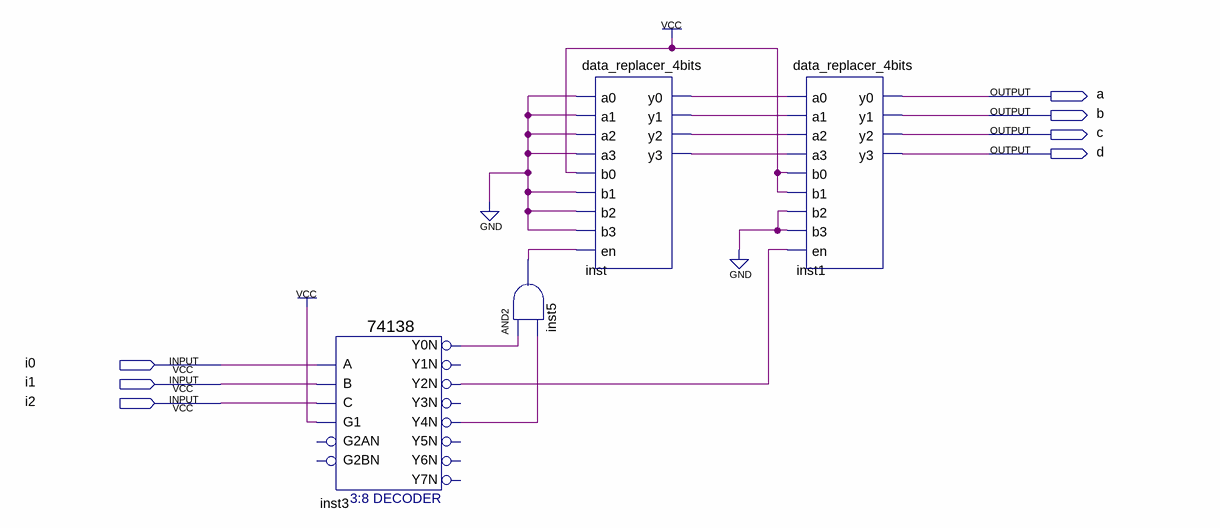
[diagram p0: schematic sheet]
// Quartus schematic data_state_picker_3b_4bitso.bdf as structural Verilog: 4 symbols, 7 pins
module data_state_picker_3b_4bitso (
  input  i0,
  input  i1,
  input  i2,
  output a,
  output b,
  output c,
  output d
);

  wire inst3_y0n, inst3_y2n, inst3_y4n, inst5_out, inst_y0, inst_y1, inst_y2, inst_y3;

  \74138  inst3 (
    .A(i0), .B(i1), .G1(1'b1), .C(i2), .Y0N(inst3_y0n), .Y2N(inst3_y2n), .Y4N(inst3_y4n));  // open: G2AN, G2BN, Y1N, Y3N, Y5N, Y6N, Y7N
  and inst5 (inst5_out, inst3_y0n, inst3_y4n);
  data_replacer_4bits inst (
    .a0(1'b0), .a1(1'b0), .a2(1'b0), .a3(1'b0), .b0(1'b1), .b1(1'b0), .b2(1'b0), .b3(1'b0), .en(inst5_out),
    .y0(inst_y0), .y1(inst_y1), .y2(inst_y2), .y3(inst_y3));
  data_replacer_4bits inst1 (
    .a0(inst_y0), .a1(inst_y1), .a2(inst_y2), .a3(inst_y3), .b0(1'b1), .b1(1'b1), .b2(1'b0), .b3(1'b0),
    .en(inst3_y2n), .y0(a), .y1(b), .y2(c), .y3(d));
endmodule
